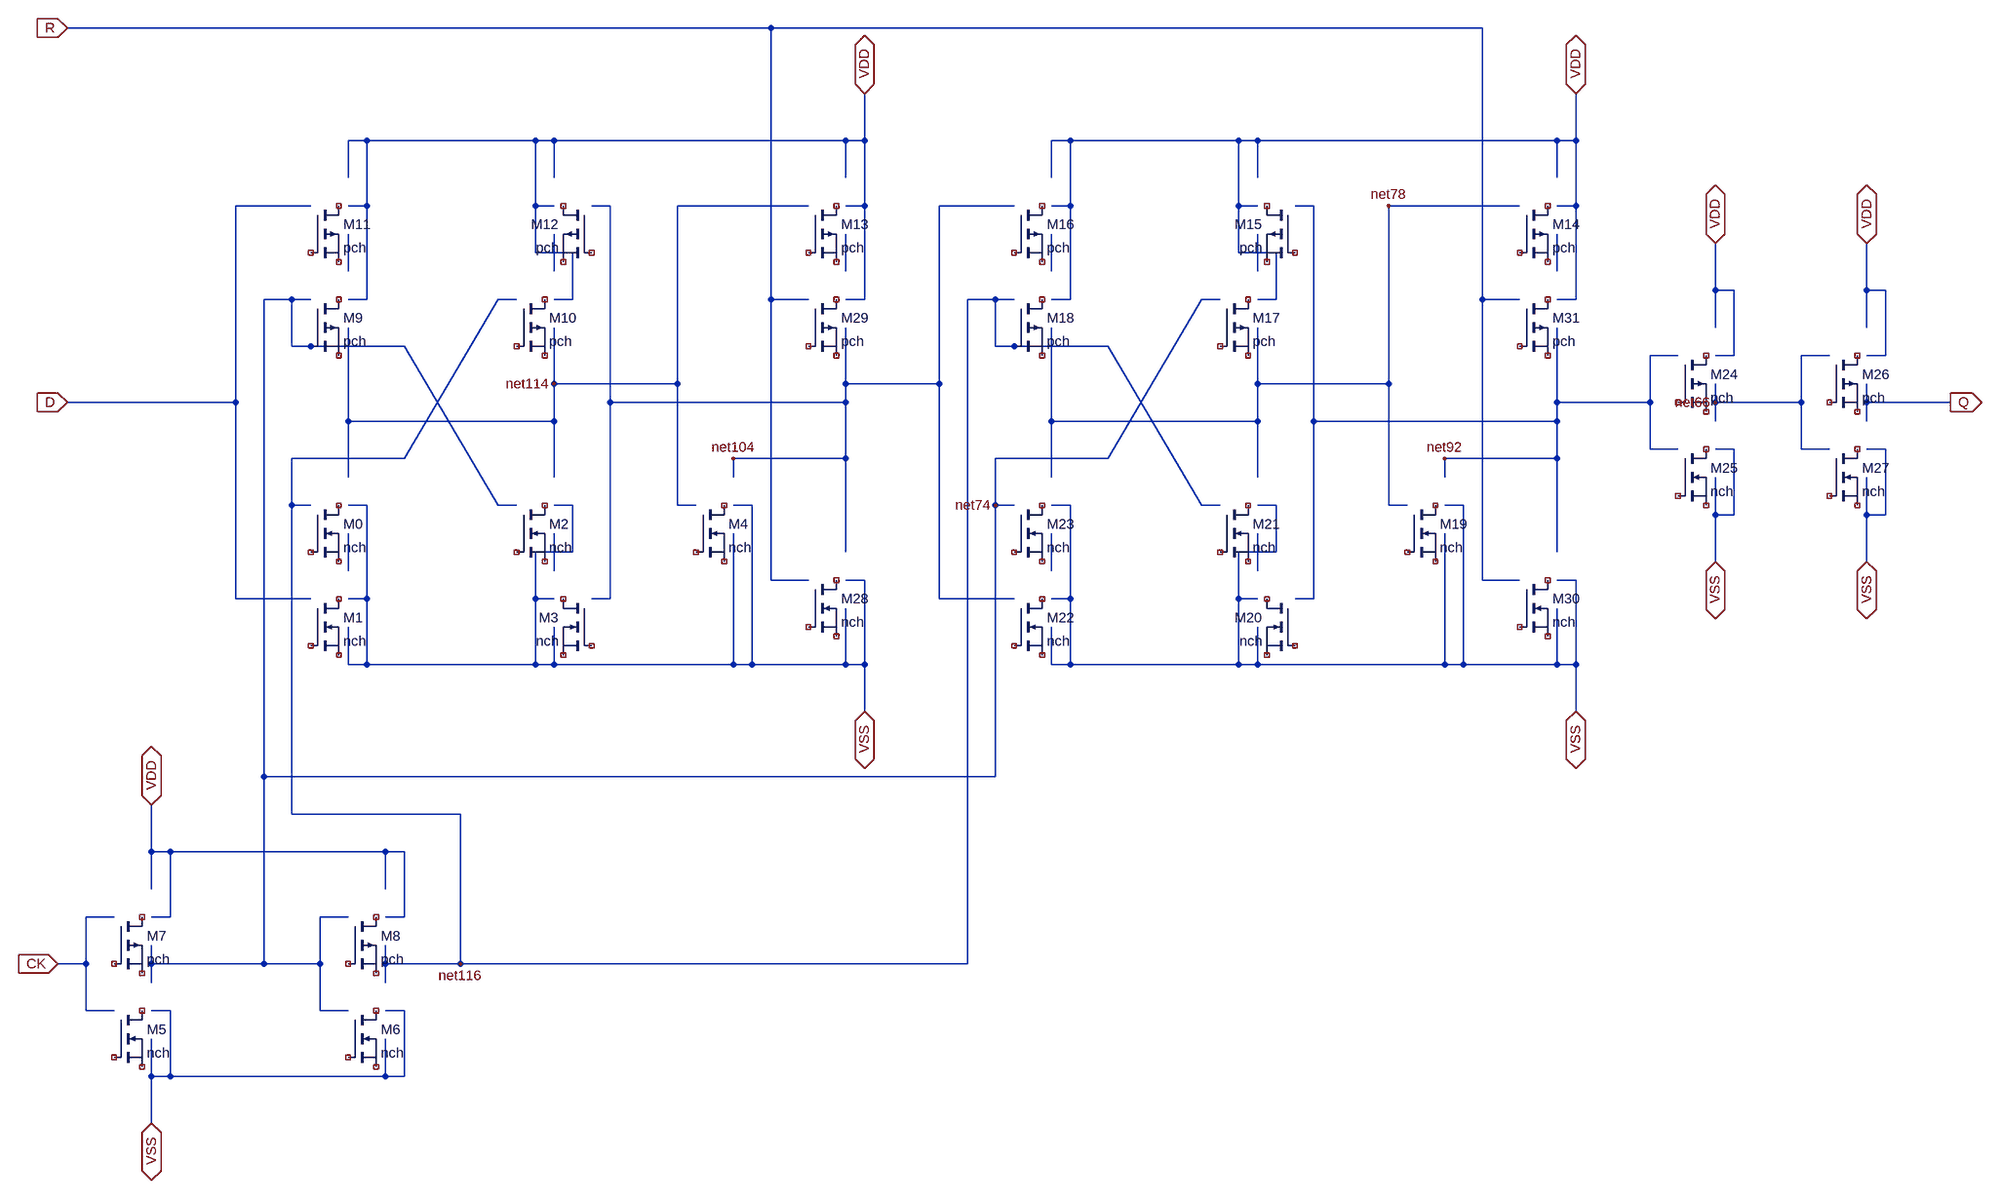
[diagram p0: schematic rff1.asc]
rff1.asc, the LTspice schematic file:
Version 4
SHEET 1 3776 1984
WIRE 2800 432 2800 368
WIRE 3264 656 3424 656
WIRE 3424 656 3424 576
WIRE 3264 656 3264 624
WIRE 3424 736 3424 656
WIRE 3424 736 3472 736
WIRE 3424 576 3472 576
WIRE 3264 688 3264 656
WIRE 944 944 944 880
WIRE 1168 624 1168 320
WIRE 944 624 1168 624
WIRE 944 624 944 528
WIRE 1168 832 1200 832
WIRE 1168 832 1168 624
WIRE 1168 320 1392 320
WIRE 592 688 944 688
WIRE 944 688 944 624
WIRE 592 688 592 528
WIRE 944 784 944 688
WIRE 592 784 592 688
WIRE 1936 944 1936 880
WIRE 2512 624 2512 320
WIRE 2512 320 2736 320
WIRE 1936 784 1936 688
WIRE 2288 784 2288 688
WIRE 1936 688 1936 528
WIRE 2288 688 2288 624
WIRE 1936 688 2288 688
WIRE 2512 832 2512 624
WIRE 2512 832 2544 832
WIRE 2288 624 2288 528
WIRE 2288 624 2512 624
WIRE 2800 752 2800 688
WIRE 2608 784 2608 752
WIRE 2608 752 2800 752
WIRE 2800 688 2800 656
WIRE 3152 736 3200 736
WIRE 3152 576 3200 576
WIRE 2384 688 2800 688
WIRE 2800 656 2800 528
WIRE 2800 656 3152 656
WIRE 2800 912 2800 752
WIRE 2352 320 2384 320
WIRE 2352 992 2384 992
WIRE 2384 992 2384 688
WIRE 2384 688 2384 320
WIRE 3152 656 3152 576
WIRE 3152 736 3152 656
WIRE 1264 784 1264 752
WIRE 1456 752 1456 656
WIRE 1264 752 1456 752
WIRE 1456 624 1456 528
WIRE 1744 992 1744 624
WIRE 1456 656 1456 624
WIRE 1744 320 1872 320
WIRE 1040 656 1456 656
WIRE 1040 656 1040 320
WIRE 1744 992 1872 992
WIRE 1456 912 1456 752
WIRE 1040 992 1040 656
WIRE 1008 992 1040 992
WIRE 1456 624 1744 624
WIRE 1008 320 1040 320
WIRE 1744 624 1744 320
WIRE 2288 944 2288 880
WIRE 1456 432 1456 368
WIRE 592 432 592 368
WIRE 1936 432 1936 368
WIRE 784 1616 1792 1616
WIRE 1792 480 1840 480
WIRE 1840 480 1872 480
WIRE 1840 560 1840 480
WIRE 1840 560 2032 560
WIRE 2192 832 2224 832
WIRE 2032 560 2192 832
WIRE 1792 1616 1792 480
WIRE 656 1616 656 1584
WIRE 496 1360 784 1360
WIRE 656 1616 784 1616
WIRE 784 1616 784 1360
WIRE 496 1360 496 832
WIRE 688 752 848 480
WIRE 656 1648 656 1616
WIRE 848 480 880 480
WIRE 496 752 688 752
WIRE 496 832 496 752
WIRE 496 832 528 832
WIRE 944 432 944 368
WIRE 592 944 592 880
WIRE 2288 432 2288 368
WIRE 1840 832 1872 832
WIRE 1840 832 1840 752
WIRE 1840 752 2032 752
WIRE 2192 480 2224 480
WIRE 2032 752 2192 480
WIRE 448 1296 1840 1296
WIRE 448 1296 448 480
WIRE 448 1616 448 1296
WIRE 448 1616 544 1616
WIRE 1840 1296 1840 832
WIRE 688 560 848 832
WIRE 256 1616 448 1616
WIRE 544 1616 544 1536
WIRE 448 480 496 480
WIRE 544 1696 544 1616
WIRE 256 1648 256 1616
WIRE 544 1536 592 1536
WIRE 544 1696 592 1696
WIRE 256 1616 256 1584
WIRE 848 832 880 832
WIRE 496 560 688 560
WIRE 496 560 496 480
WIRE 496 480 528 480
WIRE 1296 1104 1456 1104
WIRE 1456 1104 1456 1008
WIRE 1488 1104 1488 960
WIRE 1456 1104 1488 1104
WIRE 2608 1104 2640 1104
WIRE 2800 1104 2800 1008
WIRE 2640 1104 2800 1104
WIRE 2832 1104 2832 960
WIRE 2800 1104 2832 1104
WIRE 3536 848 3536 928
WIRE 3568 848 3568 736
WIRE 3536 848 3568 848
WIRE 3536 736 3568 736
WIRE 3536 784 3536 848
WIRE 3264 848 3264 928
WIRE 3296 848 3296 736
WIRE 3264 848 3296 848
WIRE 3264 736 3296 736
WIRE 3264 784 3264 848
WIRE 1936 1104 1936 1040
WIRE 1936 1104 1968 1104
WIRE 2288 1104 2288 1040
WIRE 1936 832 1968 832
WIRE 1968 1104 2256 1104
WIRE 1968 1104 1968 992
WIRE 1968 992 1968 832
WIRE 1936 992 1968 992
WIRE 2288 832 2320 832
WIRE 2320 912 2320 832
WIRE 2256 912 2320 912
WIRE 2256 1104 2288 1104
WIRE 2256 1104 2256 992
WIRE 2256 992 2256 912
WIRE 2256 992 2288 992
WIRE 2800 960 2832 960
WIRE 2288 1104 2608 1104
WIRE 2608 1104 2608 880
WIRE 2608 832 2640 832
WIRE 2640 1104 2640 832
WIRE 2832 1104 2832 1184
WIRE 256 1808 256 1888
WIRE 656 1808 688 1808
WIRE 688 1808 688 1696
WIRE 656 1696 688 1696
WIRE 288 1808 288 1696
WIRE 256 1696 288 1696
WIRE 256 1744 256 1808
WIRE 256 1808 288 1808
WIRE 656 1744 656 1808
WIRE 1456 960 1488 960
WIRE 1488 1104 1488 1184
WIRE 1264 1104 1296 1104
WIRE 1296 1104 1296 832
WIRE 1264 832 1296 832
WIRE 1264 1104 1264 880
WIRE 944 1104 1264 1104
WIRE 912 992 944 992
WIRE 912 992 912 912
WIRE 912 1104 912 992
WIRE 912 1104 944 1104
WIRE 912 912 976 912
WIRE 976 912 976 832
WIRE 944 832 976 832
WIRE 592 992 624 992
WIRE 624 992 624 832
WIRE 624 1104 624 992
WIRE 624 1104 912 1104
WIRE 592 832 624 832
WIRE 944 1104 944 1040
WIRE 592 1104 624 1104
WIRE 592 1104 592 1040
WIRE 288 1808 656 1808
WIRE 1328 480 1392 480
WIRE 1328 960 1328 480
WIRE 1328 960 1392 960
WIRE 1328 16 2672 16
WIRE 2672 480 2672 16
WIRE 2672 960 2736 960
WIRE 2672 480 2736 480
WIRE 1328 480 1328 16
WIRE 2672 960 2672 480
WIRE 112 16 1328 16
WIRE 1456 480 1488 480
WIRE 944 208 1456 208
WIRE 1488 480 1488 320
WIRE 2800 480 2832 480
WIRE 2832 480 2832 320
WIRE 2288 208 2800 208
WIRE 2800 208 2832 208
WIRE 3568 576 3568 464
WIRE 3536 464 3568 464
WIRE 3536 576 3568 576
WIRE 3536 528 3536 464
WIRE 3536 464 3536 384
WIRE 3296 576 3296 464
WIRE 3264 464 3296 464
WIRE 3264 576 3296 576
WIRE 3264 528 3264 464
WIRE 3264 464 3264 384
WIRE 1936 272 1936 208
WIRE 1936 208 1968 208
WIRE 2288 272 2288 208
WIRE 2288 480 2320 480
WIRE 2320 480 2320 400
WIRE 2256 400 2320 400
WIRE 2256 208 2288 208
WIRE 2256 400 2256 320
WIRE 2256 320 2256 208
WIRE 2256 320 2288 320
WIRE 1936 480 1968 480
WIRE 1968 208 2256 208
WIRE 1968 480 1968 320
WIRE 1968 320 1968 208
WIRE 1936 320 1968 320
WIRE 2800 272 2800 208
WIRE 2800 320 2832 320
WIRE 2832 320 2832 208
WIRE 2832 208 2832 128
WIRE 256 1424 256 1344
WIRE 656 1424 688 1424
WIRE 688 1536 688 1424
WIRE 656 1536 688 1536
WIRE 288 1536 288 1424
WIRE 256 1536 288 1536
WIRE 656 1488 656 1424
WIRE 256 1488 256 1424
WIRE 256 1424 288 1424
WIRE 1488 208 1488 128
WIRE 1488 320 1488 208
WIRE 1456 320 1488 320
WIRE 1456 272 1456 208
WIRE 1456 208 1488 208
WIRE 592 320 624 320
WIRE 624 320 624 208
WIRE 624 480 624 320
WIRE 624 208 912 208
WIRE 592 480 624 480
WIRE 912 320 944 320
WIRE 912 320 912 208
WIRE 912 400 912 320
WIRE 912 208 944 208
WIRE 912 400 976 400
WIRE 976 480 976 400
WIRE 944 480 976 480
WIRE 944 272 944 208
WIRE 592 208 624 208
WIRE 592 272 592 208
WIRE 288 1424 656 1424
WIRE 112 656 400 656
WIRE 400 656 400 320
WIRE 400 992 528 992
WIRE 400 992 400 656
WIRE 400 320 528 320
WIRE 96 1616 144 1616
WIRE 144 1616 144 1536
WIRE 144 1696 192 1696
WIRE 144 1696 144 1616
WIRE 144 1536 192 1536
WIRE 3536 656 3696 656
WIRE 3536 656 3536 624
WIRE 3536 688 3536 656
FLAG 3264 656 net66
FLAG 944 624 net114
FLAG 2512 320 net78
FLAG 2608 752 net92
FLAG 1264 752 net104
FLAG 784 1616 net116
FLAG 1840 832 net74
SYMBOL PMOS 1392 480 R0
SYMATTR InstName M29
SYMATTR Value pch
SYMATTR Value2 w=6u l=1u
SYMBOL PMOS 2736 480 R0
SYMATTR InstName M31
SYMATTR Value pch
SYMATTR Value2 w=6u l=1u
SYMBOL PMOS 3472 576 R0
SYMATTR InstName M26
SYMATTR Value pch
SYMATTR Value2 w=6u l=1u
SYMBOL PMOS 3200 576 R0
SYMATTR InstName M24
SYMATTR Value pch
SYMATTR Value2 w=6u l=1u
SYMBOL PMOS 1872 480 R0
SYMATTR InstName M18
SYMATTR Value pch
SYMATTR Value2 w=6u l=1u
SYMBOL PMOS 2224 480 R0
SYMATTR InstName M17
SYMATTR Value pch
SYMATTR Value2 w=6u l=1u
SYMBOL PMOS 1872 320 R0
SYMATTR InstName M16
SYMATTR Value pch
SYMATTR Value2 w=6u l=1u
SYMBOL PMOS 2352 320 M0
SYMATTR InstName M15
SYMATTR Value pch
SYMATTR Value2 w=6u l=1u
SYMBOL PMOS 2736 320 R0
SYMATTR InstName M14
SYMATTR Value pch
SYMATTR Value2 w=6u l=1u
SYMBOL PMOS 1392 320 R0
SYMATTR InstName M13
SYMATTR Value pch
SYMATTR Value2 w=6u l=1u
SYMBOL PMOS 1008 320 M0
SYMATTR InstName M12
SYMATTR Value pch
SYMATTR Value2 w=6u l=1u
SYMBOL PMOS 528 320 R0
SYMATTR InstName M11
SYMATTR Value pch
SYMATTR Value2 w=6u l=1u
SYMBOL PMOS 880 480 R0
SYMATTR InstName M10
SYMATTR Value pch
SYMATTR Value2 w=6u l=1u
SYMBOL PMOS 528 480 R0
SYMATTR InstName M9
SYMATTR Value pch
SYMATTR Value2 w=6u l=1u
SYMBOL PMOS 592 1536 R0
SYMATTR InstName M8
SYMATTR Value pch
SYMATTR Value2 w=6u l=1u
SYMBOL PMOS 192 1536 R0
SYMATTR InstName M7
SYMATTR Value pch
SYMATTR Value2 w=6u l=1u
SYMBOL NMOS 3472 736 R0
SYMATTR InstName M27
SYMATTR Value nch
SYMATTR Value2 w=2u l=1u
SYMBOL NMOS 3200 736 R0
SYMATTR InstName M25
SYMATTR Value nch
SYMATTR Value2 w=2u l=1u
SYMBOL NMOS 1872 832 R0
SYMATTR InstName M23
SYMATTR Value nch
SYMATTR Value2 w=2u l=1u
SYMBOL NMOS 1872 992 R0
SYMATTR InstName M22
SYMATTR Value nch
SYMATTR Value2 w=2u l=1u
SYMBOL NMOS 2224 832 R0
SYMATTR InstName M21
SYMATTR Value nch
SYMATTR Value2 w=2u l=1u
SYMBOL NMOS 2352 992 M0
SYMATTR InstName M20
SYMATTR Value nch
SYMATTR Value2 w=2u l=1u
SYMBOL NMOS 2544 832 R0
SYMATTR InstName M19
SYMATTR Value nch
SYMATTR Value2 w=2u l=1u
SYMBOL NMOS 2736 960 R0
SYMATTR InstName M30
SYMATTR Value nch
SYMATTR Value2 w=2u l=1u
SYMBOL NMOS 1392 960 R0
SYMATTR InstName M28
SYMATTR Value nch
SYMATTR Value2 w=2u l=1u
SYMBOL NMOS 592 1696 R0
SYMATTR InstName M6
SYMATTR Value nch
SYMATTR Value2 w=2u l=1u
SYMBOL NMOS 192 1696 R0
SYMATTR InstName M5
SYMATTR Value nch
SYMATTR Value2 w=2u l=1u
SYMBOL NMOS 1200 832 R0
SYMATTR InstName M4
SYMATTR Value nch
SYMATTR Value2 w=2u l=1u
SYMBOL NMOS 1008 992 M0
SYMATTR InstName M3
SYMATTR Value nch
SYMATTR Value2 w=2u l=1u
SYMBOL NMOS 880 832 R0
SYMATTR InstName M2
SYMATTR Value nch
SYMATTR Value2 w=2u l=1u
SYMBOL NMOS 528 992 R0
SYMATTR InstName M1
SYMATTR Value nch
SYMATTR Value2 w=2u l=1u
SYMBOL NMOS 528 832 R0
SYMATTR InstName M0
SYMATTR Value nch
SYMATTR Value2 w=2u l=1u
FLAG 3696 656 Q
IOPIN 3696 656 Out
FLAG 3536 384 VDD
IOPIN 3536 384 BiDir
FLAG 3536 928 VSS
IOPIN 3536 928 BiDir
FLAG 3264 384 VDD
IOPIN 3264 384 BiDir
FLAG 3264 928 VSS
IOPIN 3264 928 BiDir
FLAG 2832 1184 VSS
IOPIN 2832 1184 BiDir
FLAG 2832 128 VDD
IOPIN 2832 128 BiDir
FLAG 256 1344 VDD
IOPIN 256 1344 BiDir
FLAG 256 1888 VSS
IOPIN 256 1888 BiDir
FLAG 1488 1184 VSS
IOPIN 1488 1184 BiDir
FLAG 1488 128 VDD
IOPIN 1488 128 BiDir
FLAG 112 16 R
IOPIN 112 16 In
FLAG 112 656 D
IOPIN 112 656 In
FLAG 96 1616 CK
IOPIN 96 1616 In

The netlist it stands for:
* rff1.asc
* M29: pch w=6u l=1u (symbol PMOS not certain, pin order unknown); nets seen at it: 
* M31: pch w=6u l=1u (symbol PMOS not certain, pin order unknown); nets seen at it: 
* M26: pch w=6u l=1u (symbol PMOS not certain, pin order unknown); nets seen at it: 
* M24: pch w=6u l=1u (symbol PMOS not certain, pin order unknown); nets seen at it: 
* M18: pch w=6u l=1u (symbol PMOS not certain, pin order unknown); nets seen at it: net116
* M17: pch w=6u l=1u (symbol PMOS not certain, pin order unknown); nets seen at it: 
* M16: pch w=6u l=1u (symbol PMOS not certain, pin order unknown); nets seen at it: 
* M15: pch w=6u l=1u (symbol PMOS not certain, pin order unknown); nets seen at it: 
* M14: pch w=6u l=1u (symbol PMOS not certain, pin order unknown); nets seen at it: 
* M13: pch w=6u l=1u (symbol PMOS not certain, pin order unknown); nets seen at it: 
* M12: pch w=6u l=1u (symbol PMOS not certain, pin order unknown); nets seen at it: 
* M11: pch w=6u l=1u (symbol PMOS not certain, pin order unknown); nets seen at it: 
* M10: pch w=6u l=1u (symbol PMOS not certain, pin order unknown); nets seen at it: 
* M9: pch w=6u l=1u (symbol PMOS not certain, pin order unknown); nets seen at it: net74
* M8: pch w=6u l=1u (symbol PMOS not certain, pin order unknown); nets seen at it: 
* M7: pch w=6u l=1u (symbol PMOS not certain, pin order unknown); nets seen at it: 
* M27: nch w=2u l=1u (symbol NMOS not certain, pin order unknown); nets seen at it: 
* M25: nch w=2u l=1u (symbol NMOS not certain, pin order unknown); nets seen at it: 
* M23: nch w=2u l=1u (symbol NMOS not certain, pin order unknown); nets seen at it: 
* M22: nch w=2u l=1u (symbol NMOS not certain, pin order unknown); nets seen at it: 
* M21: nch w=2u l=1u (symbol NMOS not certain, pin order unknown); nets seen at it: 
* M20: nch w=2u l=1u (symbol NMOS not certain, pin order unknown); nets seen at it: 
* M19: nch w=2u l=1u (symbol NMOS not certain, pin order unknown); nets seen at it: 
* M30: nch w=2u l=1u (symbol NMOS not certain, pin order unknown); nets seen at it: 
* M28: nch w=2u l=1u (symbol NMOS not certain, pin order unknown); nets seen at it: 
* M6: nch w=2u l=1u (symbol NMOS not certain, pin order unknown); nets seen at it: 
* M5: nch w=2u l=1u (symbol NMOS not certain, pin order unknown); nets seen at it: 
* M4: nch w=2u l=1u (symbol NMOS not certain, pin order unknown); nets seen at it: 
* M3: nch w=2u l=1u (symbol NMOS not certain, pin order unknown); nets seen at it: 
* M2: nch w=2u l=1u (symbol NMOS not certain, pin order unknown); nets seen at it: 
* M1: nch w=2u l=1u (symbol NMOS not certain, pin order unknown); nets seen at it: 
* M0: nch w=2u l=1u (symbol NMOS not certain, pin order unknown); nets seen at it: 
.backanno
.end